# EAGLE schematic schematic (EAGLE 9.4.2)
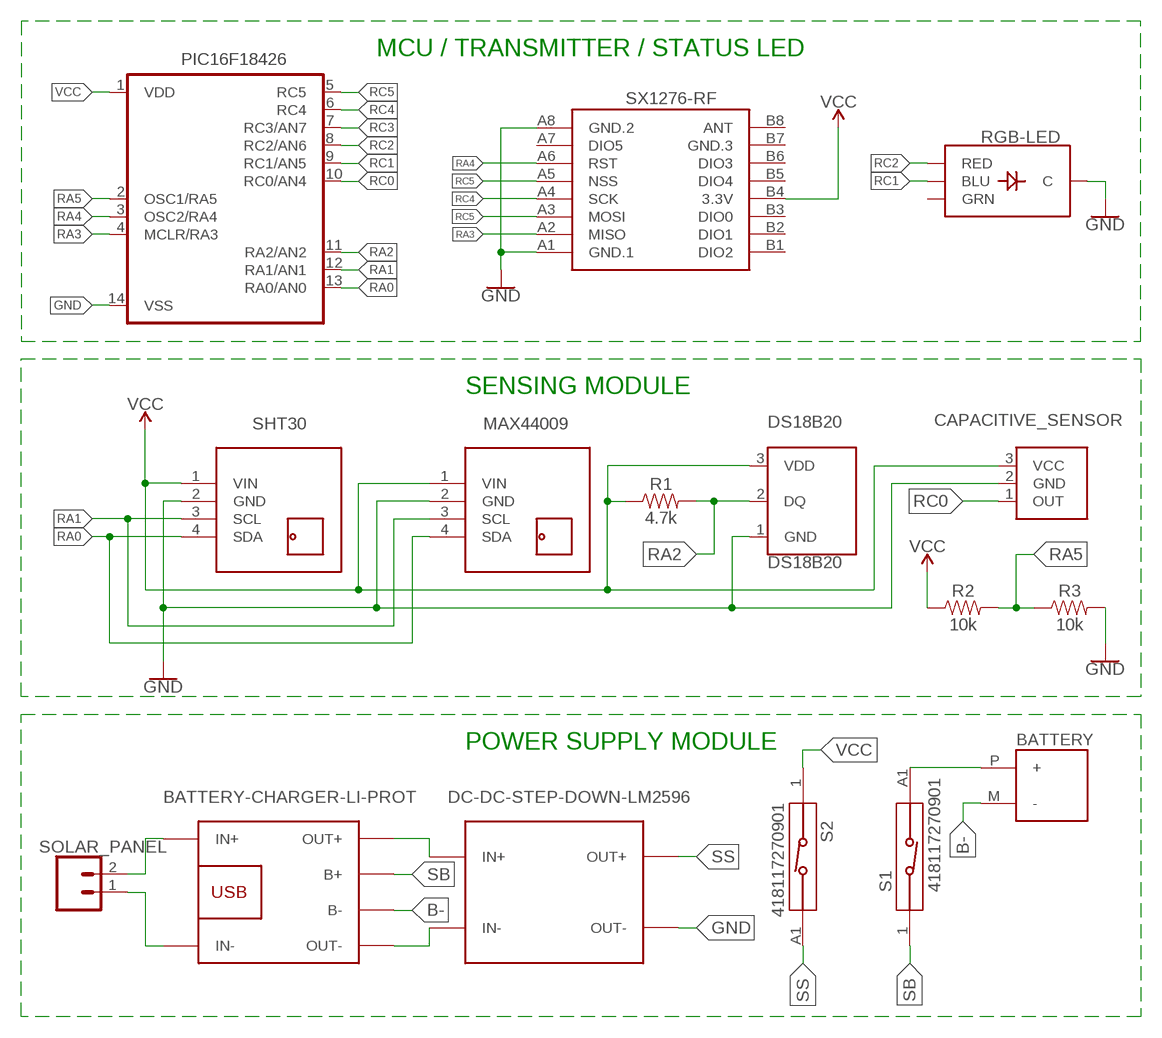
[diagram p0: schematic, sheet 1]

## Parts
BATTERY  BK-18650-PC2  [MPD_BK-18650-PC2]
CAPACITIVE_SENSOR  BRM-2508RA  [BRM-2508]
DS18B20  DS18B20  [TO-92-AMMO]
MAX44009  TEMP-HUM-SENSOR-HTU21D  [TEMP-HUM-SENSOR-HTU21D]
PIC16F18426  PIC16F8DIL  [DIL14]
R1  4.7k  4.7KOHM-0603-1/10W-1%  [0603]
R2  10k  10KOHM-HORIZ-1/4W-1%  [AXIAL-0.3]
R3  10k  10KOHM-HORIZ-1/4W-1%  [AXIAL-0.3]
RGB-LED  DIFFUSE  LED-RGB-CCDIFFUSE  [LED-RGB-THRU]
S1  418117270901  [418117270901]
S2  418117270901  [418117270901]
SHT30  TEMP-HUM-SENSOR-HTU21D  [TEMP-HUM-SENSOR-HTU21D]
SOLAR_PANEL  CONN_02LOCK_LONGPADS  [1X02_LOCK_LONGPADS]
SX1276-RF  WIRELESS-LORA-RFM95W#THT  [WIRELESS-LORA-RFM95W#THT]
U$1  DC-DC-STEP-DOWN-LM2596  [DC-DC-STEP-DOWN-LM2596]
U$2  BATTERY-CHARGER-LI-PROT  [BATTERY-CHARGER-LI-PROT]

## Nets
B-: BATTERY.M(-) U$2.B-
GND: CAPACITIVE_SENSOR.2(GND) DS18B20.1(GND) MAX44009.2(GND) PIC16F18426.14(VSS) RGB-LED.2(C) SHT30.2(GND) SX1276-RF.A1(GND.1) SX1276-RF.A8(GND.2) U$1.OUT-
N$1: U$1.IN+ U$2.OUT+
N$2: SOLAR_PANEL.1 U$2.IN-
N$3: BATTERY.P(+) S1.A1
N$6: U$1.IN- U$2.OUT-
N$9: SOLAR_PANEL.2 U$2.IN+
N$11: R3.P$2 ; supply symbol labelled GND
RA0: MAX44009.4(SDA) PIC16F18426.13(RA0/AN0) SHT30.4(SDA)
RA1: MAX44009.3(SCL) PIC16F18426.12(RA1/AN1) SHT30.3(SCL)
RA2: DS18B20.2(DQ) PIC16F18426.11(RA2/AN2) R1.2
RA3: PIC16F18426.4(MCLR/RA3) SX1276-RF.A2(MISO)
RA4: PIC16F18426.3(OSC2/RA4) SX1276-RF.A6(RST)
RA5: PIC16F18426.2(OSC1/RA5) R2.P$2 R3.P$1
RC0: CAPACITIVE_SENSOR.1(OUT) PIC16F18426.10(RC0/AN4)
RC1: PIC16F18426.9(RC1/AN5) RGB-LED.4(BLU)
RC2: PIC16F18426.8(RC2/AN6) RGB-LED.1(RED)
RC3: PIC16F18426.7(RC3/AN7)
RC4: PIC16F18426.6(RC4) SX1276-RF.A4(SCK)
RC5: PIC16F18426.5(RC5) SX1276-RF.A3(MOSI) SX1276-RF.A5(NSS)
SB: S1.1 U$2.B+
SS: S2.A1 U$1.OUT+
VCC: CAPACITIVE_SENSOR.3(VCC) DS18B20.3(VDD) MAX44009.1(VIN) PIC16F18426.1(VDD) R1.1 R2.P$1 S2.1 SHT30.1(VIN) SX1276-RF.B4(3.3V)
Unconnected: RGB-LED.3(GRN) SX1276-RF.A7(DIO5) SX1276-RF.B1(DIO2) SX1276-RF.B2(DIO1) SX1276-RF.B3(DIO0) SX1276-RF.B5(DIO4) SX1276-RF.B6(DIO3) SX1276-RF.B8(ANT)

## Notes on the sheet
- MCU / TRANSMITTER / STATUS LED
- SENSING MODULE
- POWER SUPPLY MODULE

## Power pins joined to a net without a drawn wire
GND.3: SX1276-RF.B7(GND.3)

## Library data of the parts
BATTERY = BK-18650-PC2:BK-18650-PC2: HOLDER BATT 1/LI-ION PROTECTED; AVAILABILITY: Unavailable; DESCRIPTION: Holder Batt 1/Li-Ion Protected; MF: MPD _Memory; MP: BK-18650-PC2; PACKAGE: DFN-14 MPD _Memory Protection Devices_; PRICE: None
CAPACITIVE_SENSOR = SparkFun-Sensors:BRM-2508: BRM-2508 IR Receiver Module 2.7V/5.5V IR Receiver with Low Power Consumption, High-immunity Against Ambient Light. Example Datasheet <http://www.sinoskysun.com/upload/20110512/201105120447164615.PDF>; PROD_ID: COMP-12059
DS18B20 = SparkFun-Sensors:DS18B20: Dallas/Maxim DS18B20 1-Wire Temperature Sensor The DS18B20 reports degrees C with 9 to 12-bit precision, -55C to 125C (+/-0.5C). Each sensor has a unique 64-Bit Serial number etched into it - allows for a huge number of sensors to be used on one data bus. Datasheet <http://datasheets.maximintegrated.com/en/ds/DS18B20.pdf> SparkFun Products One Wire Digital Temperature Sensor - DS18B20 <https://www.sparkfun.com/products/245> (SEN-00245); STORE_ID: SEN-00245
MAX44009 SHT30 = diy-modules:TEMP-HUM-SENSOR-HTU21D: Digital Humidity & Temperature Sensor based on HTU21D device More information about HTU21D device is available here: http://futureeverything.org/wp-content/uploads/2014/05/Humidity-Datasheet.pdf HTU21D Arudino Library is available here: https://learn.sparkfun.com/tutorials/htu21d-humidity-sensor-hookup-guide/htu21d-library-and-functions Click here to find device on ebay.com <http://www.ebay.com/sch/htu21d+board>
PIC16F18426 = pic16f6xx_14pin:PIC16F8*: MICROCONTROLLER 14-Pin, 8-Bit PIC16F8X Family - CMOS Flash Pin Compatible : 16F630, 16F676, 16F684, 16F688 Keywords: PIC16F630, PIC16F676, PIC16F684, PIC16F688
R1 = SparkFun-Resistors:4.7KOHM: 4.7kΩ resistor A resistor is a passive two-terminal electrical component that implements electrical resistance as a circuit element. Resistors act to reduce current flow, and, at the same time, act to lower voltage levels within circuits. - Wikipedia; PROD_ID: RES-07857
R2 R3 = SparkFun-Resistors:10KOHM: 10kΩ resistor A resistor is a passive two-terminal electrical component that implements electrical resistance as a circuit element. Resistors act to reduce current flow, and, at the same time, act to lower voltage levels within circuits. - Wikipedia; PROD_ID: RES-12183
RGB-LED = SparkFun-LED:LED-RGB-CC: LED-RGB Common Cathode Packages: LED RGB-THRU LED_PIRANHA_5MM SparkFun Products: RGB Diffused Common Cathode- Diffuse <[https://www.sparkfun.com/products/9264]> RGB Diffused Common Cathode - Clear <[https://www.sparkfun.com/products/105]> LED-RGB 5mm Square (Piranha) <[https://www.sparkfun.com/products/11679]>; PROD_ID: DIO-09434
S1 S2 = switch_dip:418117270901: 2.54 mm compact THT with raised actuator WS-DITV, 1 Pole <http://katalog.we-online.de/media/images/v2/Family_WS_BS_4181172709xx_pf2.jpg> Details see: http://katalog.we-online.de/en/em/DITV_2_54_COMPACT_THT_WITH_RAISED_ACTUATOR 2015 (C) Wurth Elektronik; AVAILABILITY: Unavailable; DESCRIPTION: Switch Slide Dip Spst 25ma 24v; MF: Wurth Electronics; MP: 418117270901; PACKAGE: None; PRICE: None
SOLAR_PANEL = SparkFun-Connectors:CONN_02: Multi connection point. Often used as Generic Header-pin footprint for 0.1 inch spaced/style header connections On any of the 0.1 inch spaced packages, you can populate with these: Break Away Headers - Straight <https://www.sparkfun.com/products/116> (PRT-00116) Break Away Male Headers - Right Angle <https://www.sparkfun.com/products/553> (PRT-00553) Female Headers <https://www.sparkfun.com/products/115> (PRT-00115) Break Away Headers - Machine Pin <https://www.sparkfun.com/products/117> (PRT-00117) Break Away Female Headers - Swiss Machine Pin <https://www.sparkfun.com/products/743> (PRT-00743) For SCREWTERMINALS and SPRING TERMINALS visit here: Screw Terimnals on SparkFun.com <https://www.sparkfun.com/search/results?term=Screw+Terminals> (5mm/3.5mm/2.54mm spacing) This device is also useful as a general connection point to wire up your design to another part of your project. Our various solder wires solder well into these plated through hole pads. Hook-Up Wire - Assortment (Stranded, 22 AWG) <https://www.sparkfun.com/products/11375> (PRT-11375) Hook-Up Wire - Assortment (Solid Core, 22 AWG) <https://www.sparkfun.com/products/11367> (PRT-11367) View the entire wire category on our website here <https://www.sparkfun.com/categories/141> Special notes: Molex polarized connector foot print use with: PRT-08233 with associated crimp pins and housings. 2.54_SCREWTERM for use with PRT-10571. 3.5mm Screw Terminal footprints for PRT-08084 5mm Screw Terminal footprints for use with PRT-08432
SX1276-RF = diy-modules:WIRELESS-LORA-RFM95W: 868/915 MHz LoRa Radio Transceiver Module based on SX1276 chip Click here to find device on ebay.com <http://www.ebay.com/sch/RFM95W+transceiver>
U$1 = diy-modules:DC-DC-STEP-DOWN-LM2596: DC/DC Step-Down Regulator based on LM2596-ADJ chip LM2596 datasheet available here: http://www.ti.com/lit/ds/symlink/lm2596.pdf Click here to find device on ebay.com <http://www.ebay.com/sch/lm2596+power+regulator>
U$2 = diy-modules:BATTERY-CHARGER-LI-PROT: Lithium Battery 5V Charger with protection circuit More details available here: http://www.instructables.com/id/DIY-Lithium-ion-Battery-Charger/step4/TP4056-based-lithium-ion-battery-charger-module/ Click here to find device on ebay.com <http://www.ebay.com/sch/tp4056+charger+usb+protection>

## Net classes
0 default: clearance 0.205 mm